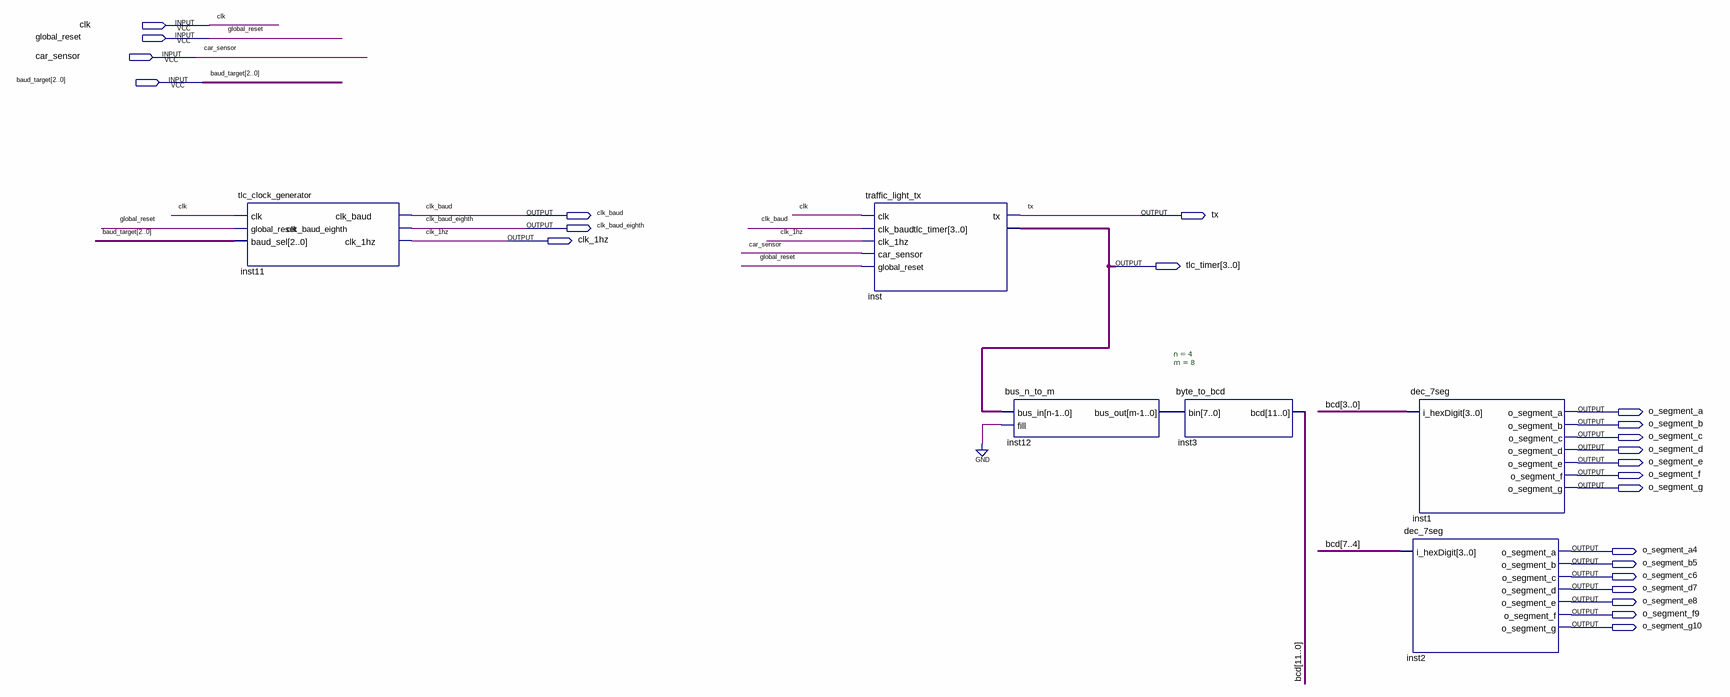
[diagram p0: schematic sheet]
// Quartus schematic uartProject.bdf as structural Verilog: 6 symbols, 23 pins
module uartProject (
  input  clk,
  input  global_reset,
  input  car_sensor,
  input  [2:0] baud_target,
  output clk_baud,
  output tx,
  output clk_baud_eighth,
  output clk_1hz,
  output [3:0] tlc_timer,
  output o_segment_a,
  output o_segment_b,
  output o_segment_c,
  output o_segment_d,
  output o_segment_e,
  output o_segment_f,
  output o_segment_g,
  output o_segment_a4,
  output o_segment_b5,
  output o_segment_c6,
  output o_segment_d7,
  output o_segment_e8,
  output o_segment_f9,
  output o_segment_g10
);

  wire [7:0] inst12_bus_out;
  wire [11:0] bcd;

  tlc_clock_generator inst11 (
    .clk(clk), .global_reset(global_reset), .baud_sel(baud_target), .clk_baud(clk_baud),
    .clk_baud_eighth(clk_baud_eighth), .clk_1hz(clk_1hz));
  traffic_light_tx inst (
    .clk(clk), .clk_baud(clk_baud), .clk_1hz(clk_1hz), .car_sensor(car_sensor), .global_reset(global_reset),
    .tx(tx), .tlc_timer(tlc_timer));
  bus_n_to_m #(.n(4), .m(8)) inst12 (.bus_in(tlc_timer), .fill(1'b0), .bus_out(inst12_bus_out));
  byte_to_bcd inst3 (.bin(inst12_bus_out), .bcd(bcd));
  dec_7seg inst1 (
    .i_hexDigit(bcd[3:0]), .o_segment_a(o_segment_a), .o_segment_b(o_segment_b), .o_segment_c(o_segment_c),
    .o_segment_d(o_segment_d), .o_segment_e(o_segment_e), .o_segment_f(o_segment_f), .o_segment_g(o_segment_g));
  dec_7seg inst2 (
    .i_hexDigit(bcd[7:4]), .o_segment_a(o_segment_a4), .o_segment_b(o_segment_b5),
    .o_segment_c(o_segment_c6), .o_segment_d(o_segment_d7), .o_segment_e(o_segment_e8),
    .o_segment_f(o_segment_f9), .o_segment_g(o_segment_g10));
endmodule
